# EasyEDA schematic SCH_Life-Counter_2024-05-18.json
TITLE: Sheet_1; REV: 1.0; Date: 2024-05-18; Sheet: 1/1; Drawn By: wildbush; Company: Your Company
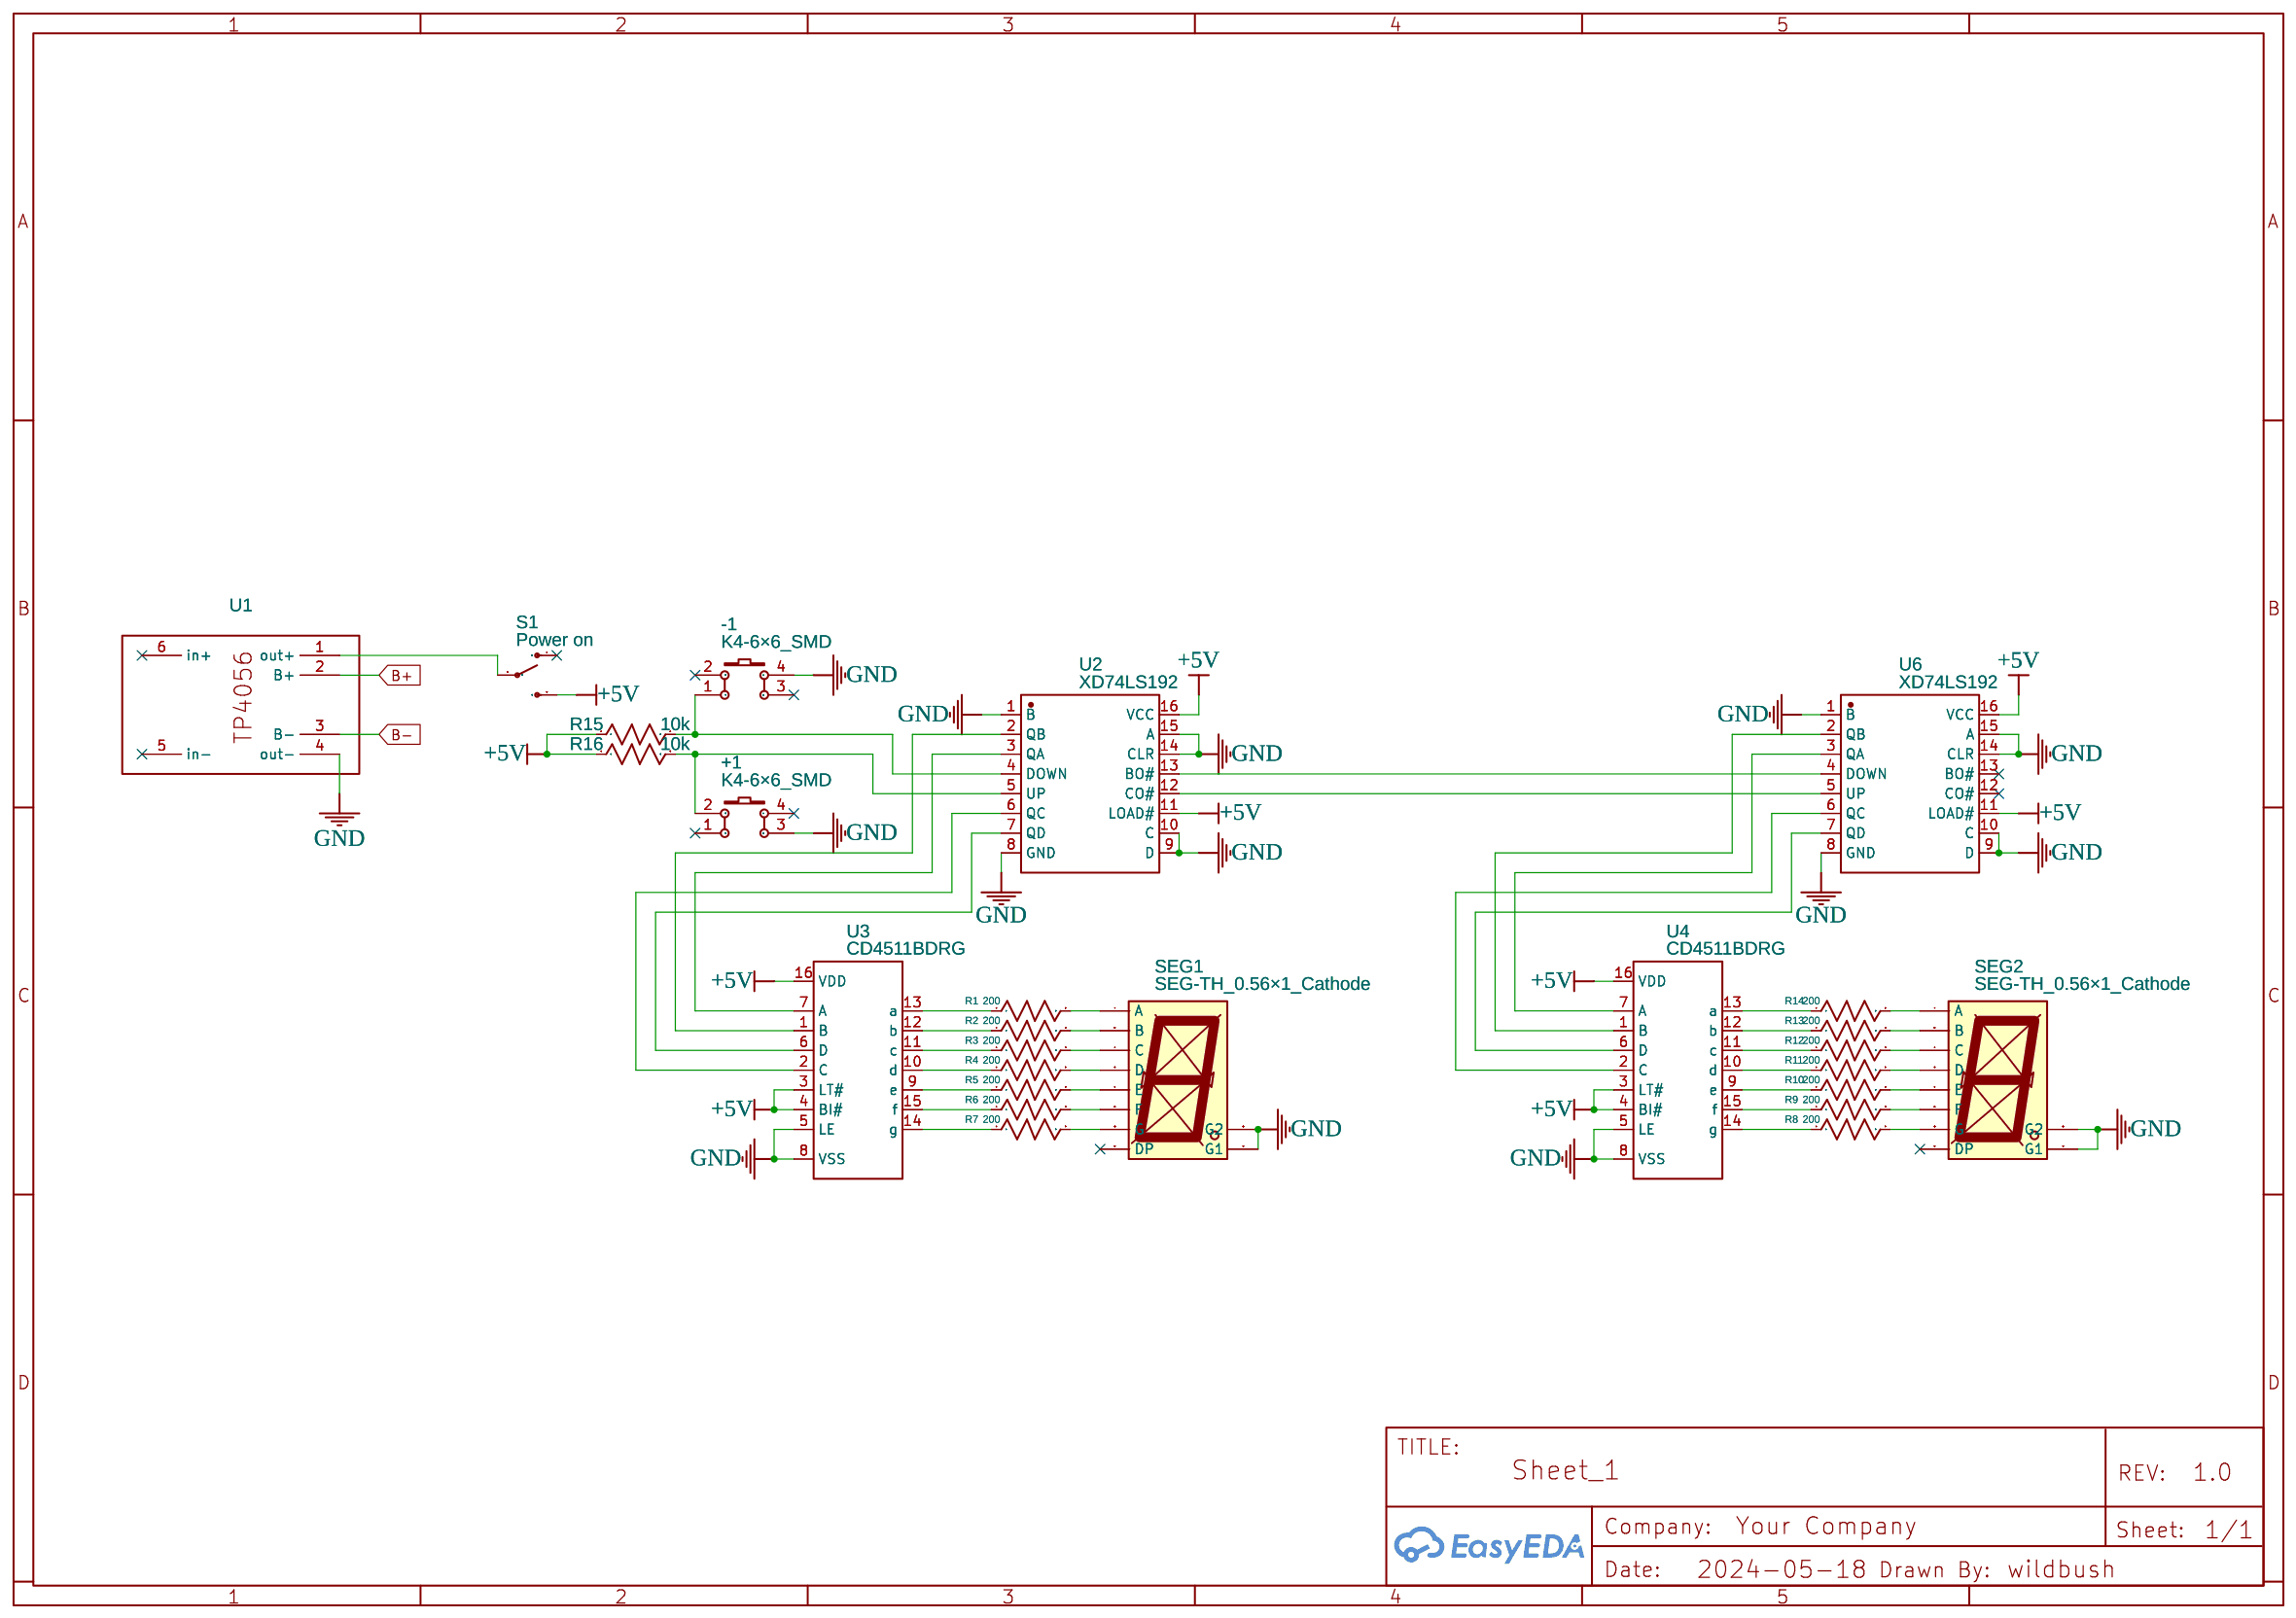
[diagram p0: schematic sheet]

## Parts
+1  K4-6×6_SMD  [KEY-SMD_4P-L6.0-W6.0-P3.90-LS10.0]
-1  K4-6×6_SMD  [KEY-SMD_4P-L6.0-W6.0-P3.90-LS10.0]
R1  200  [R_AXIAL-0.3]
R2  200  [R_AXIAL-0.3]
R3  200  [R_AXIAL-0.3]
R4  200  [R_AXIAL-0.3]
R5  200  [R_AXIAL-0.3]
R6  200  [R_AXIAL-0.3]
R7  200  [R_AXIAL-0.3]
R8  200  [R_AXIAL-0.3]
R9  200  [R_AXIAL-0.3]
R10  200  [R_AXIAL-0.3]
R11  200  [R_AXIAL-0.3]
R12  200  [R_AXIAL-0.3]
R13  200  [R_AXIAL-0.3]
R14  200  [R_AXIAL-0.3]
R15  10k  [R_AXIAL-0.3]
R16  10k  [R_AXIAL-0.3]
S1  Power on  [SWITCH-SPDT_KIT]
SEG1  SEG-TH_0.56×1_Cathode  [LED-SEG-TH_10P-L12.6-W19.0-P2.54-S15.24-BL]
SEG2  SEG-TH_0.56×1_Cathode  [LED-SEG-TH_10P-L12.6-W19.0-P2.54-S15.24-BL]
U1  NO  [TP4056]
U2  XD74LS192  [DIP-16_L19.3-W6.4-P2.54-LS7.6-BL]
U3  CD4511BDRG  [SOP-16_L10.0-W3.9-P1.27-LS6.0-BL]
U4  CD4511BDRG  [SOP-16_L10.0-W3.9-P1.27-LS6.0-BL]
U6  XD74LS192  [DIP-16_L19.3-W6.4-P2.54-LS7.6-BL]

## Library data of the parts
+1 -1 = K4-6×6_SMD: Supplier Part: C191626; Supplier: LCSC; Manufacturer: 韩国韩荣; Manufacturer Part: K2-6639SP-D4SC-04; Contributor: LCEDA_Lib
R1-R16 = R_AXIAL-0.3_US: Contributor: LCEDA_Lib
S1 = SWITCH-SPDT: Contributor: SparkFun
SEG1 SEG2 = SEG-TH_0.56×1_Cathode: Manufacturer: 志浩; Supplier Part: C8093; Contributor: LCEDA_01
U1 = TP4056: Contributor: petewedi
U2 U6 = XD74LS192: Contributor: LCSC; Supplier: LCSC; Supplier Part: C609768; Manufacturer: XINLUDA(信路达); JLCPCB Part Class: Extended Part
U3 U4 = CD4511BDRG: Contributor: lcsc; Supplier: LCSC; Supplier Part: C5145431; Manufacturer: HGC(深圳汉芯); JLCPCB Part Class: Extended Part

## Nets
+5V: R15.1 R16.1 S1.3(S) U2.11(LOAD#) U2.16(VCC) U3.3(LT#) U3.4(BI#) U3.16(VDD) U4.3(LT#) U4.4(BI#) U4.16(VDD) U6.11(LOAD#) U6.16(VCC)
GND: +1.3 -1.4 SEG1.3(G1) SEG1.8(G2) SEG2.3(G1) SEG2.8(G2) U1.4(out-) U2.1(B) U2.8(GND) U2.9(D) U2.10(C) U2.14(CLR) U2.15(A) U3.5(LE) U3.8(VSS) U4.5(LE) U4.8(VSS) U6.1(B) U6.8(GND) U6.9(D) U6.10(C) U6.14(CLR) U6.15(A)
B+: U1.2(B+)
B-: U1.3(B-)
Net-(+1-2): +1.2 R16.2 U2.5(UP)
Net-(-1-1): -1.1 R15.2 U2.4(DOWN)
Net-(R1-1): R1.1 U3.13(a)
Net-(R1-2): R1.2 SEG1.7(A)
Net-(R2-1): R2.1 U3.12(b)
Net-(R2-2): R2.2 SEG1.6(B)
Net-(R3-1): R3.1 U3.11(c)
Net-(R3-2): R3.2 SEG1.4(C)
Net-(R4-1): R4.1 U3.10(d)
Net-(R4-2): R4.2 SEG1.2(D)
Net-(R5-1): R5.1 U3.9(e)
Net-(R5-2): R5.2 SEG1.1(E)
Net-(R6-1): R6.1 U3.15(f)
Net-(R6-2): R6.2 SEG1.9(F)
Net-(R7-1): R7.1 U3.14(g)
Net-(R7-2): R7.2 SEG1.10(G)
Net-(R8-1): R8.1 U4.14(g)
Net-(R8-2): R8.2 SEG2.10(G)
Net-(R9-1): R9.1 U4.15(f)
Net-(R9-2): R9.2 SEG2.9(F)
Net-(R10-1): R10.1 U4.9(e)
Net-(R10-2): R10.2 SEG2.1(E)
Net-(R11-1): R11.1 U4.10(d)
Net-(R11-2): R11.2 SEG2.2(D)
Net-(R12-1): R12.1 U4.11(c)
Net-(R12-2): R12.2 SEG2.4(C)
Net-(R13-1): R13.1 U4.12(b)
Net-(R13-2): R13.2 SEG2.6(B)
Net-(R14-1): R14.1 U4.13(a)
Net-(R14-2): R14.2 SEG2.7(A)
Net-(S1-2): S1.2(P) U1.1(out+)
Net-(U2-2): U2.2(QB) U3.1(B)
Net-(U2-3): U2.3(QA) U3.7(A)
Net-(U2-6): U2.6(QC) U3.2(C)
Net-(U2-7): U2.7(QD) U3.6(D)
Net-(U2-12): U2.12(CO#) U6.5(UP)
Net-(U2-13): U2.13(BO#) U6.4(DOWN)
Net-(U4-1): U4.1(B) U6.2(QB)
Net-(U4-2): U4.2(C) U6.6(QC)
Net-(U4-6): U4.6(D) U6.7(QD)
Net-(U4-7): U4.7(A) U6.3(QA)

Not connected (* = marked no-connect by the designer): +1 1* 4*; -1 2* 3*; S1 1(O)*; SEG1 5(DP)*; SEG2 5(DP)*; U1 5(in-)* 6(in+)*; U6 12(CO#)* 13(BO#)*
